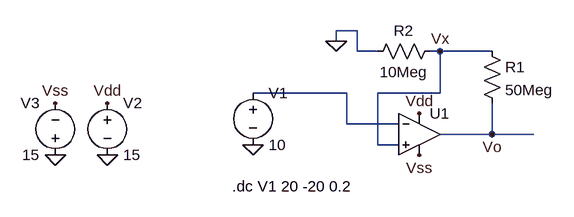
[diagram p0: schematic Schmitt Trigger.asc]
Schmitt Trigger.asc, the LTspice schematic file:
Version 4
SHEET 1 880 680
WIRE 192 64 160 64
WIRE 160 80 160 64
WIRE 192 96 192 64
WIRE 224 96 192 96
WIRE 320 96 304 96
WIRE 400 96 320 96
WIRE 176 160 32 160
WIRE 320 160 320 96
WIRE 320 160 224 160
WIRE 176 208 176 160
WIRE 256 208 176 208
WIRE 400 224 400 176
WIRE 400 224 320 224
WIRE 464 224 400 224
WIRE 224 240 224 160
WIRE 256 240 224 240
FLAG 32 240 0
FLAG 160 80 0
FLAG 400 224 Vo
FLAG 320 96 Vx
FLAG 288 192 Vdd
FLAG -192 176 Vdd
FLAG 288 256 Vss
FLAG -272 176 Vss
FLAG -272 256 0
FLAG -192 256 0
SYMBOL voltage 32 144 R0
WINDOW 123 0 0 Left 0
WINDOW 39 0 0 Left 0
SYMATTR InstName V1
SYMATTR Value 10
SYMBOL res 384 80 R0
SYMATTR InstName R1
SYMATTR Value 50Meg
SYMBOL res 320 80 R90
WINDOW 0 0 56 VBottom 2
WINDOW 3 32 56 VTop 2
SYMATTR InstName R2
SYMATTR Value 10Meg
SYMBOL Opamps\\UniversalOpamp2 288 224 R0
SYMATTR InstName U1
SYMBOL voltage -192 160 R0
WINDOW 123 0 0 Left 0
WINDOW 39 0 0 Left 0
SYMATTR InstName V2
SYMATTR Value 15
SYMBOL voltage -272 272 R180
WINDOW 0 24 96 Left 2
WINDOW 3 24 16 Left 2
SYMATTR InstName V3
SYMATTR Value 15
TEXT 0 304 Left 2 !.dc V1 20 -20 0.2

The netlist it stands for:
* Schmitt Trigger.asc
V1 N001 0 10
R1 Vx Vo 50Meg
R2 Vx 0 10Meg
XU1 Vx N001 Vdd Vss Vo level.2 Avol=1Meg GBW=10Meg Slew=10Meg ilimit=25m rail=0 Vos=0 phimargin=45 en=0 enk=0 in=0 ink=0 Rin=500Meg  ; pins IN+ IN- V+ V- OUT
V2 Vdd 0 15
V3 0 Vss 15
.dc V1 20 -20 0.2
.lib UniversalOpamps2.sub
.backanno
.end